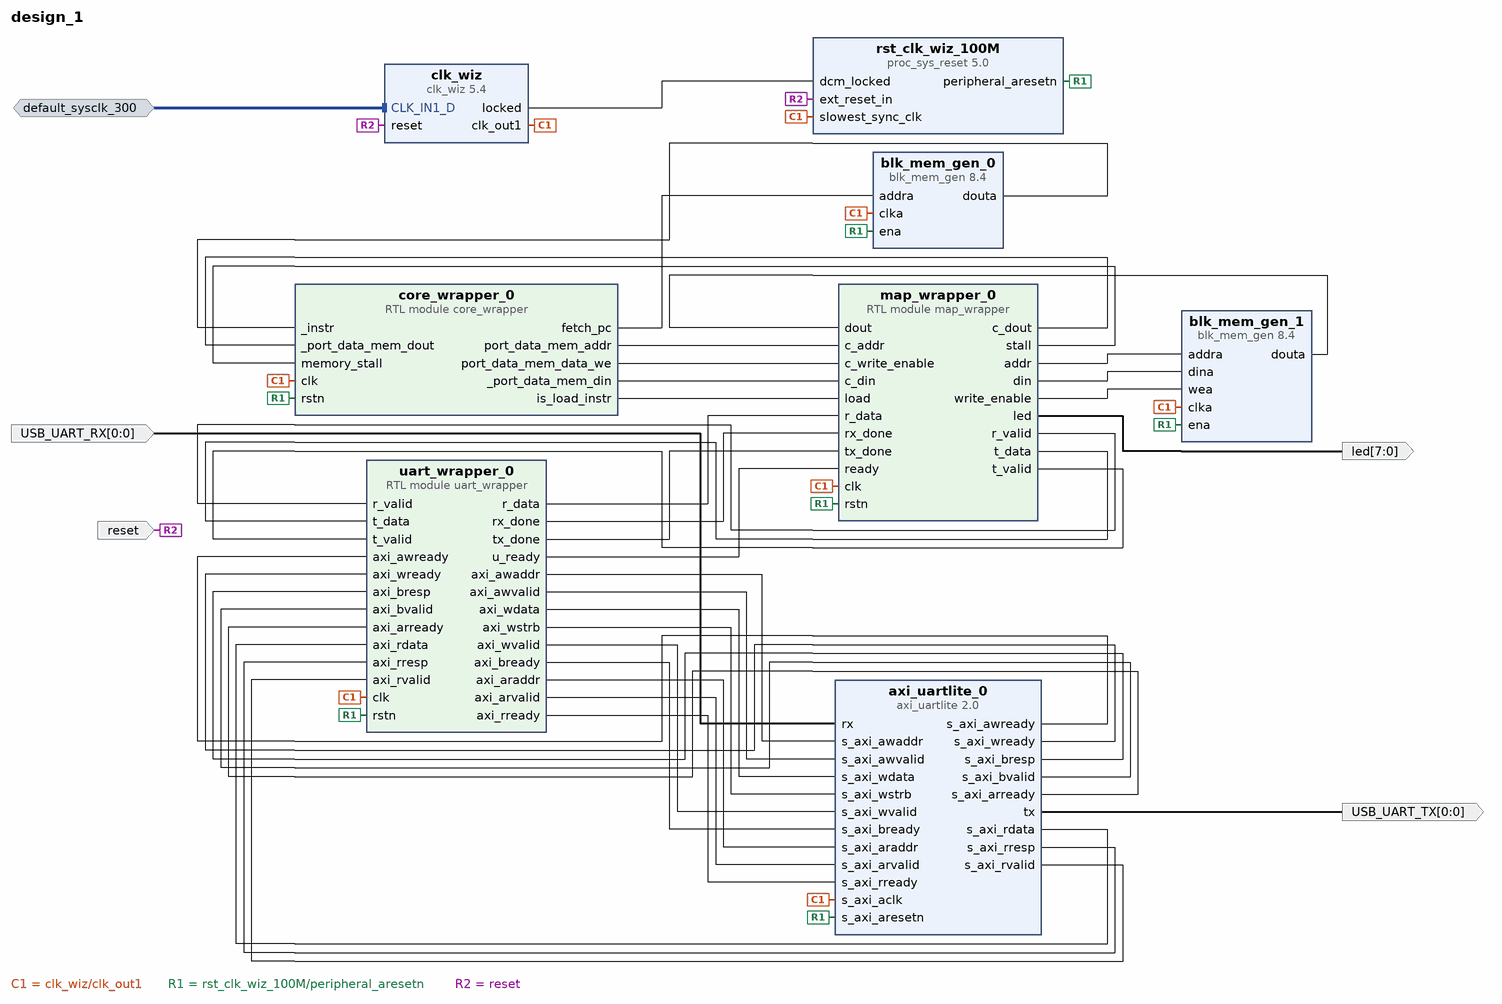
[diagram p0: block diagram of the top level]
# Vivado block design design_1, xcku040-ffva1156-2-e, Vivado 2017.4
create_bd_design design_1

create_bd_intf_port -mode Slave -vlnv xilinx.com:interface:diff_clock_rtl:1.0 default_sysclk_300
set_property -dict {CONFIG.FREQ_HZ 300000000} [get_bd_intf_ports default_sysclk_300]
create_bd_port -dir I -from 0 -to 0 -type data USB_UART_RX
create_bd_port -dir O -from 0 -to 0 USB_UART_TX
create_bd_port -dir O -from 7 -to 0 -type data led
create_bd_port -dir I -type rst reset
set_property -dict {CONFIG.POLARITY ACTIVE_HIGH} [get_bd_ports reset]

create_bd_cell -type ip -vlnv xilinx.com:ip:axi_uartlite:2.0 axi_uartlite_0
set_property -dict {CONFIG.C_BAUDRATE 460800} [get_bd_cells axi_uartlite_0]
create_bd_cell -type ip -vlnv xilinx.com:ip:blk_mem_gen:8.4 blk_mem_gen_0
set_property -dict [list \
  CONFIG.Memory_Type Single_Port_ROM \
  CONFIG.Enable_32bit_Address true \
  CONFIG.Write_Depth_A 26000 \
  CONFIG.Register_PortA_Output_of_Memory_Primitives false \
  CONFIG.Load_Init_File true \
  CONFIG.Coe_File {../../../../../../../../../ダウンロード/h.coe} \
  CONFIG.Use_RSTA_Pin false \
  CONFIG.Port_A_Write_Rate 0 \
  CONFIG.use_bram_block Stand_Alone \
] [get_bd_cells blk_mem_gen_0]
create_bd_cell -type ip -vlnv xilinx.com:ip:blk_mem_gen:8.4 blk_mem_gen_1
set_property -dict [list \
  CONFIG.Enable_32bit_Address true \
  CONFIG.Write_Depth_A 262144 \
  CONFIG.Register_PortA_Output_of_Memory_Primitives false \
  CONFIG.Load_Init_File true \
  CONFIG.Coe_File {../../../../../../../../../ダウンロード/h.coe} \
  CONFIG.Use_RSTA_Pin false \
  CONFIG.use_bram_block Stand_Alone \
] [get_bd_cells blk_mem_gen_1]
create_bd_cell -type ip -vlnv xilinx.com:ip:clk_wiz:5.4 clk_wiz
set_property -dict [list \
  CONFIG.CLKOUT1_REQUESTED_OUT_FREQ 210.000 \
  CONFIG.MMCM_DIVCLK_DIVIDE 5 \
  CONFIG.MMCM_CLKFBOUT_MULT_F 16.625 \
  CONFIG.MMCM_CLKOUT0_DIVIDE_F 4.750 \
  CONFIG.USE_BOARD_FLOW true \
  CONFIG.CLK_IN1_BOARD_INTERFACE default_sysclk_300 \
  CONFIG.RESET_BOARD_INTERFACE reset \
  CONFIG.CLKOUT1_JITTER 124.654 \
  CONFIG.CLKOUT1_PHASE_ERROR 117.553 \
] [get_bd_cells clk_wiz]
create_bd_cell -type ip -vlnv xilinx.com:ip:proc_sys_reset:5.0 rst_clk_wiz_100M
set_property -dict {CONFIG.USE_BOARD_FLOW true CONFIG.RESET_BOARD_INTERFACE reset} [get_bd_cells rst_clk_wiz_100M]
create_bd_cell -type module -reference uart_wrapper uart_wrapper_0
create_bd_cell -type module -reference map_wrapper map_wrapper_0
create_bd_cell -type module -reference core_wrapper core_wrapper_0

# ---- connections ----

connect_bd_intf_net -intf_net default_sysclk_300_1 [get_bd_intf_ports default_sysclk_300] [get_bd_intf_pins clk_wiz/CLK_IN1_D]
connect_bd_net [get_bd_ports USB_UART_RX] [get_bd_pins axi_uartlite_0/rx]
connect_bd_net [get_bd_pins axi_uartlite_0/tx] [get_bd_ports USB_UART_TX]
connect_bd_net [get_bd_pins blk_mem_gen_0/douta] [get_bd_pins core_wrapper_0/_instr]
connect_bd_net [get_bd_pins blk_mem_gen_1/douta] [get_bd_pins map_wrapper_0/dout]
connect_bd_net [get_bd_pins core_wrapper_0/fetch_pc] [get_bd_pins blk_mem_gen_0/addra]
connect_bd_net [get_bd_pins core_wrapper_0/port_data_mem_addr] [get_bd_pins map_wrapper_0/c_addr]
connect_bd_net [get_bd_pins core_wrapper_0/port_data_mem_data_we] [get_bd_pins map_wrapper_0/c_write_enable]
connect_bd_net -net core_wrapper_0_port_data_mem_din [get_bd_pins core_wrapper_0/_port_data_mem_din] [get_bd_pins map_wrapper_0/c_din]
connect_bd_net [get_bd_pins map_wrapper_0/addr] [get_bd_pins blk_mem_gen_1/addra]
connect_bd_net [get_bd_pins map_wrapper_0/c_dout] [get_bd_pins core_wrapper_0/_port_data_mem_dout]
connect_bd_net [get_bd_pins map_wrapper_0/din] [get_bd_pins blk_mem_gen_1/dina]
connect_bd_net [get_bd_pins map_wrapper_0/led] [get_bd_ports led]
connect_bd_net [get_bd_pins map_wrapper_0/r_valid] [get_bd_pins uart_wrapper_0/r_valid]
connect_bd_net [get_bd_pins map_wrapper_0/t_data] [get_bd_pins uart_wrapper_0/t_data]
connect_bd_net [get_bd_pins map_wrapper_0/t_valid] [get_bd_pins uart_wrapper_0/t_valid]
connect_bd_net [get_bd_pins map_wrapper_0/write_enable] [get_bd_pins blk_mem_gen_1/wea]
connect_bd_net -net sim_clk_gen_0_clk [get_bd_pins clk_wiz/clk_out1] \
  [get_bd_pins blk_mem_gen_0/clka] [get_bd_pins axi_uartlite_0/s_axi_aclk] [get_bd_pins blk_mem_gen_1/clka] \
  [get_bd_pins rst_clk_wiz_100M/slowest_sync_clk] [get_bd_pins uart_wrapper_0/clk] [get_bd_pins map_wrapper_0/clk] \
  [get_bd_pins core_wrapper_0/clk]
connect_bd_net [get_bd_pins uart_wrapper_0/r_data] [get_bd_pins map_wrapper_0/r_data]
connect_bd_net [get_bd_pins uart_wrapper_0/rx_done] [get_bd_pins map_wrapper_0/rx_done]
connect_bd_net [get_bd_pins uart_wrapper_0/tx_done] [get_bd_pins map_wrapper_0/tx_done]
connect_bd_net [get_bd_pins uart_wrapper_0/u_ready] [get_bd_pins map_wrapper_0/ready]
connect_bd_net [get_bd_pins core_wrapper_0/is_load_instr] [get_bd_pins map_wrapper_0/load]
connect_bd_net [get_bd_pins map_wrapper_0/stall] [get_bd_pins core_wrapper_0/memory_stall]
connect_bd_net [get_bd_pins rst_clk_wiz_100M/peripheral_aresetn] \
  [get_bd_pins axi_uartlite_0/s_axi_aresetn] [get_bd_pins blk_mem_gen_0/ena] [get_bd_pins blk_mem_gen_1/ena] \
  [get_bd_pins uart_wrapper_0/rstn] [get_bd_pins map_wrapper_0/rstn] [get_bd_pins core_wrapper_0/rstn]
connect_bd_net [get_bd_ports reset] [get_bd_pins clk_wiz/reset] [get_bd_pins rst_clk_wiz_100M/ext_reset_in]
connect_bd_net [get_bd_pins clk_wiz/locked] [get_bd_pins rst_clk_wiz_100M/dcm_locked]
connect_bd_net [get_bd_pins uart_wrapper_0/axi_awaddr] [get_bd_pins axi_uartlite_0/s_axi_awaddr]
connect_bd_net [get_bd_pins uart_wrapper_0/axi_awvalid] [get_bd_pins axi_uartlite_0/s_axi_awvalid]
connect_bd_net [get_bd_pins axi_uartlite_0/s_axi_awready] [get_bd_pins uart_wrapper_0/axi_awready]
connect_bd_net [get_bd_pins uart_wrapper_0/axi_wdata] [get_bd_pins axi_uartlite_0/s_axi_wdata]
connect_bd_net [get_bd_pins uart_wrapper_0/axi_wstrb] [get_bd_pins axi_uartlite_0/s_axi_wstrb]
connect_bd_net [get_bd_pins uart_wrapper_0/axi_wvalid] [get_bd_pins axi_uartlite_0/s_axi_wvalid]
connect_bd_net [get_bd_pins axi_uartlite_0/s_axi_wready] [get_bd_pins uart_wrapper_0/axi_wready]
connect_bd_net [get_bd_pins axi_uartlite_0/s_axi_bresp] [get_bd_pins uart_wrapper_0/axi_bresp]
connect_bd_net [get_bd_pins axi_uartlite_0/s_axi_bvalid] [get_bd_pins uart_wrapper_0/axi_bvalid]
connect_bd_net [get_bd_pins uart_wrapper_0/axi_bready] [get_bd_pins axi_uartlite_0/s_axi_bready]
connect_bd_net [get_bd_pins uart_wrapper_0/axi_araddr] [get_bd_pins axi_uartlite_0/s_axi_araddr]
connect_bd_net [get_bd_pins uart_wrapper_0/axi_arvalid] [get_bd_pins axi_uartlite_0/s_axi_arvalid]
connect_bd_net [get_bd_pins axi_uartlite_0/s_axi_arready] [get_bd_pins uart_wrapper_0/axi_arready]
connect_bd_net [get_bd_pins axi_uartlite_0/s_axi_rdata] [get_bd_pins uart_wrapper_0/axi_rdata]
connect_bd_net [get_bd_pins axi_uartlite_0/s_axi_rresp] [get_bd_pins uart_wrapper_0/axi_rresp]
connect_bd_net [get_bd_pins axi_uartlite_0/s_axi_rvalid] [get_bd_pins uart_wrapper_0/axi_rvalid]
connect_bd_net [get_bd_pins uart_wrapper_0/axi_rready] [get_bd_pins axi_uartlite_0/s_axi_rready]

validate_bd_design
save_bd_design
